# Altium schematic sheet Quad FC V10.0.SchDoc
size A3 portrait; SheetNumber: 1; SheetTotal: 2
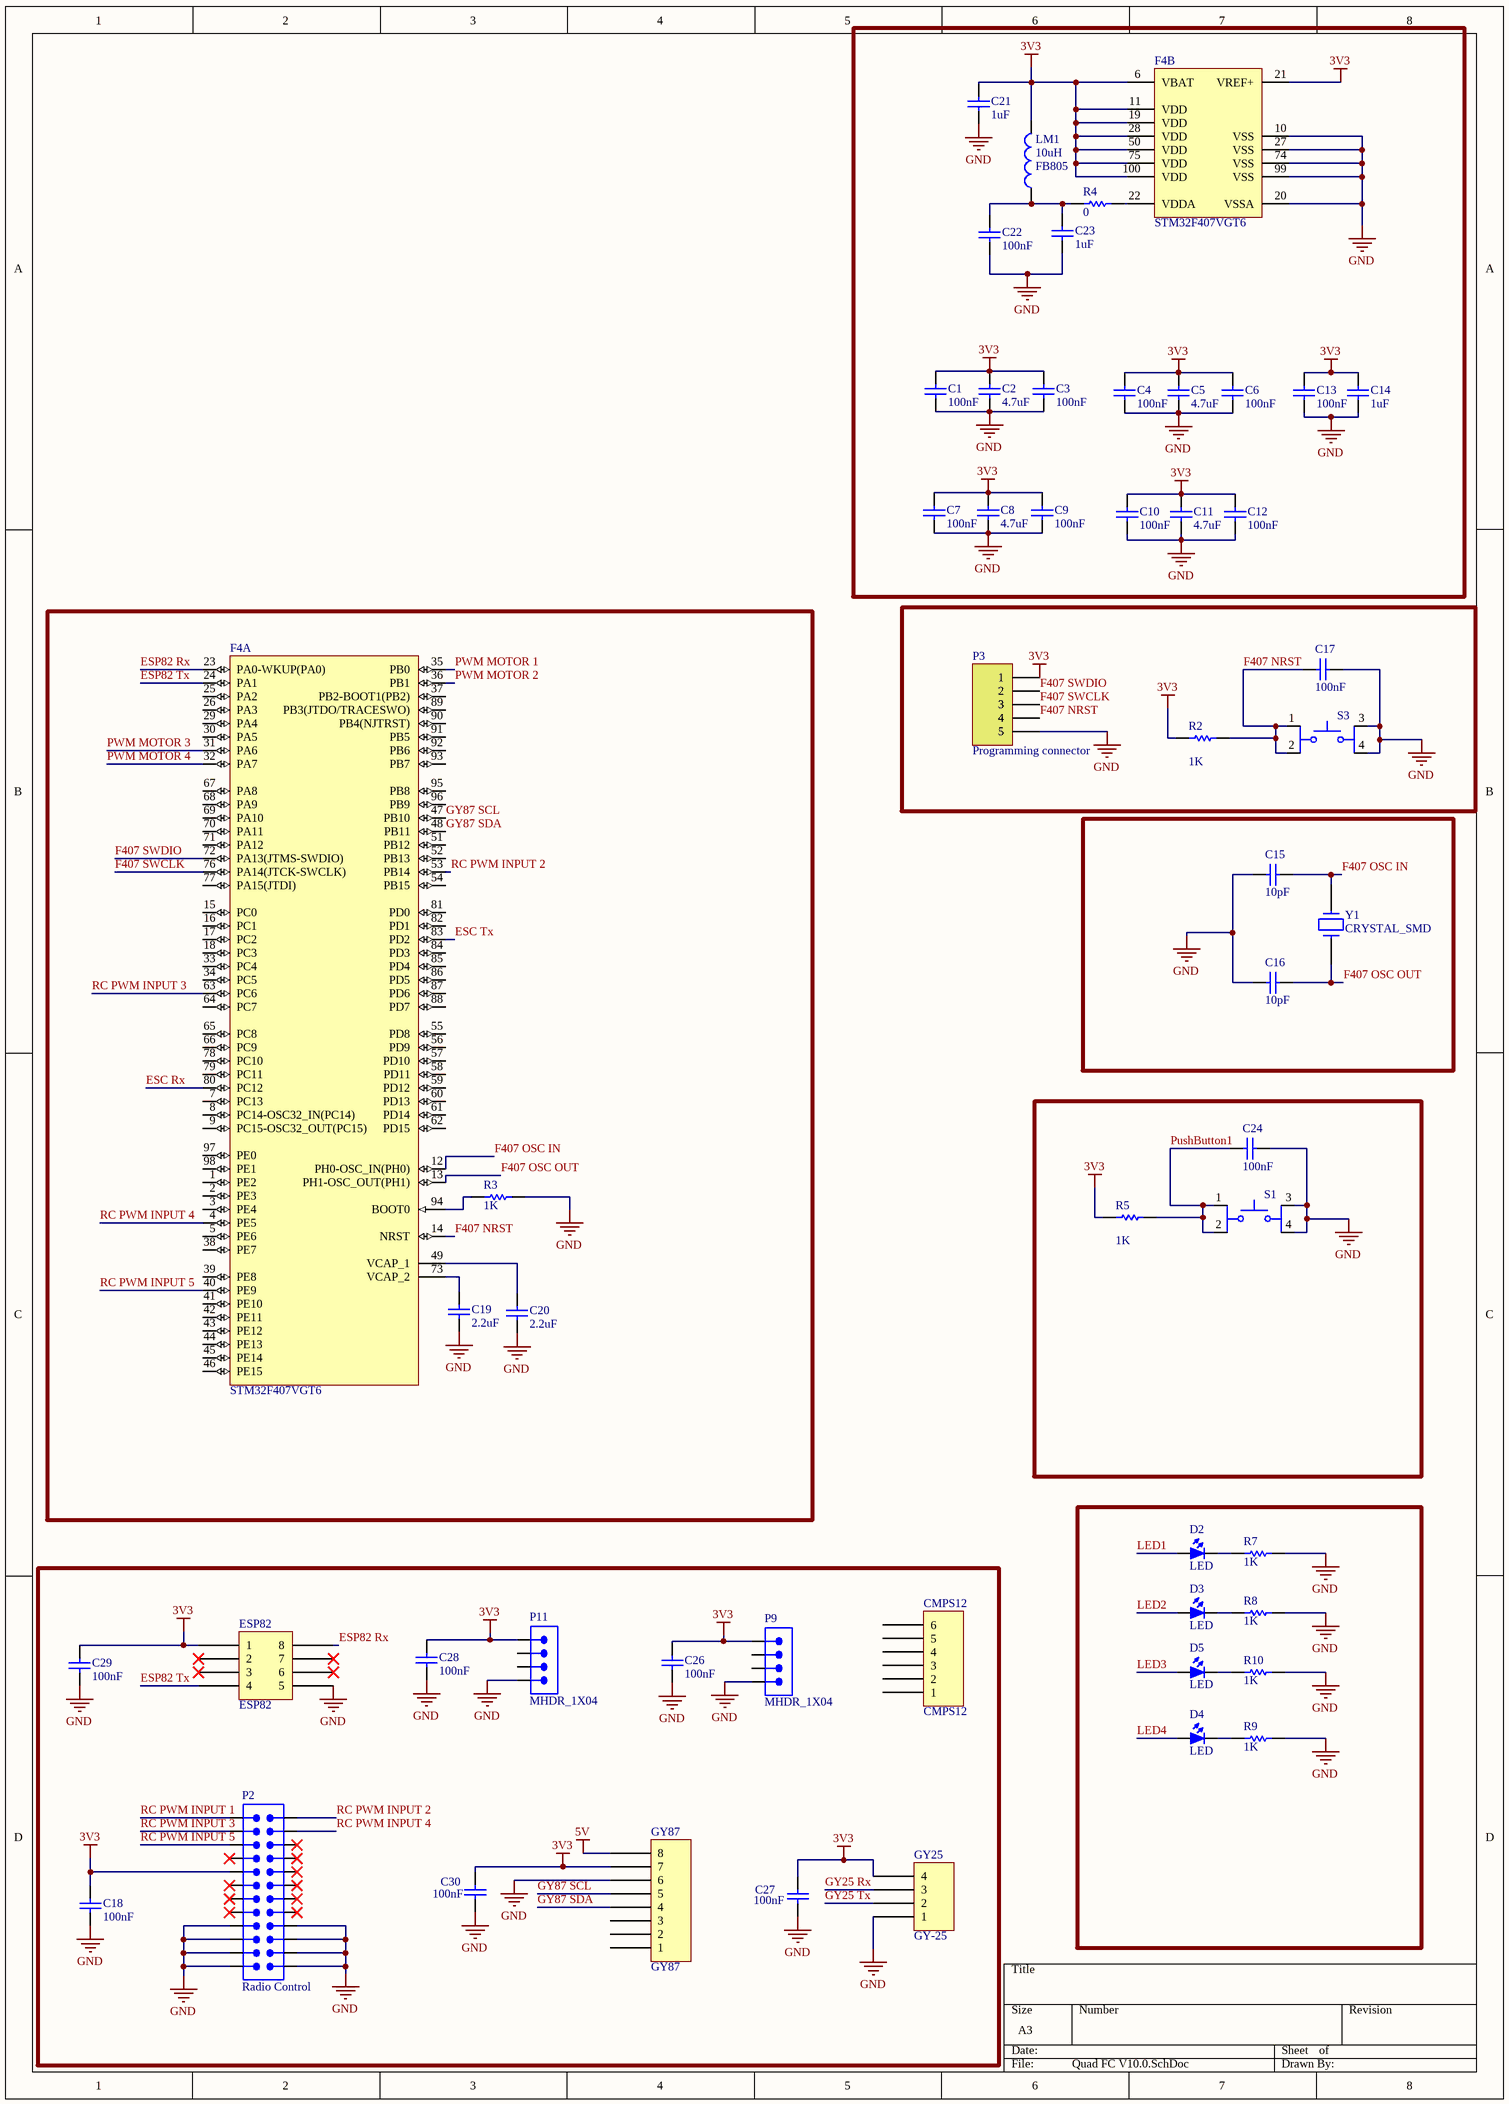
[diagram p0: Quad FC V10.0.SchDoc]

## Parts
C1  100nF  [CAP0603]
C2  4.7uF  [CAP0603]
C3  100nF  [CAP0603]
C4  100nF  [CAP0603]
C5  4.7uF  [CAP0603]
C6  100nF  [CAP0603]
C7  100nF  [CAP0603]
C8  4.7uF  [CAP0603]
C9  100nF  [CAP0603]
C10  100nF  [CAP0603]
C11  4.7uF  [CAP0603]
C12  100nF  [CAP0603]
C13  100nF  [CAP0603]
C14  1uF  [CAP0603]
C15  10pF  [CAP0603]
C16  10pF  [CAP0603]
C17  100nF  [CAP0603]
C18  100nF  [CAP0603]
C19  2.2uF  [CAP0603]
C20  2.2uF  [CAP0603]
C21  1uF  [CAP0603]
C22  100nF  [CAP0603]
C23  1uF  [CAP0603]
C24  100nF  [CAP0603]
C26  100nF  [CAP0603]
C27  100nF  [CAP0603]
C28  100nF  [CAP0603]
C29  100nF  [CAP0603]
C30  100nF  [CAP0603]
CMPS12  CMPS12  [SULLINS NPPN061BFCN]
D2  LED  [0603 - LED]
D3  LED  [0603 - LED]
D4  LED  [0603 - LED]
D5  LED  [0603 - LED]
ESP82  ESP82  [HARWIN M20-7830445]
F4  STM32F407VGT6  [STM-LQFP100_N]  (parts A,B of 2)
GY25  GY-25  [SULLINS NPPN041BFCN]
GY87  GY87  [SULLINS NPPN081BFCN]
LM1  10uH  value FB805  [0805L]
P2  Radio Control  [HEADER8X3]
P3  Programming connector  [Connector1X5]
P9  MHDR_1X04  [JST BM04B-SURS-TF]
P11  MHDR_1X04  [JST BM04B-SURS-TF]
R2  1K  [RES0603]
R3  1K  [RES0603]
R4  0  [RES0603]
R5  1K  [RES0603]
R7  1K  [RES0603]
R8  1K  [RES0603]
R9  1K  [RES0603]
R10  1K  [RES0603]
S1  (no value)  [SW_TL3301FF160QG]
S3  (no value)  [SW_TL3301FF160QG]
Y1  CRYSTAL_SMD  [My_Crystal - SMD]

## Nets
3V3: C1.2 C2.2 C3.2 C4.2 C5.2 C6.2 C7.2 C8.2 C9.2 C10.2 C11.2 C12.2 C13.1 C14.1 C18.1 C21.2 C26.1 C27.1 C28.1 C29.1 C30.2 ESP82.1 F4.6(VBAT) F4.11(VDD) F4.19(VDD) F4.21(VREF+) F4.28(VDD) F4.50(VDD) F4.75(VDD) F4.100(VDD) GY25.4 GY87.7 LM1.2 P2.9 P3.1 P9.1 P11.1 R2.1 R5.1
5V: GY87.8
GND: C1.1 C2.1 C3.1 C4.1 C5.1 C6.1 C7.1 C8.1 C9.1 C10.1 C11.1 C12.1 C13.2 C14.2 C15.1 C16.2 C17.2 C18.2 C19.2 C20.2 C21.1 C22.1 C23.1 C24.2 C26.2 C27.2 C28.2 C29.2 C30.1 ESP82.5 F4.10(VSS) F4.20(VSSA) F4.27(VSS) F4.74(VSS) F4.99(VSS) GY25.1 GY87.6 P2.17 P2.18 P2.19 P2.20 P2.21 P2.22 P2.23 P2.24 P3.5 P9.4 P11.4 R3.2 R7.2 R8.2 R9.2 R10.2 S1.3 S1.4 S3.3 S3.4
ESC Rx: F4.80(PC12)
ESC Tx: F4.83(PD2)
ESP82 Rx: ESP82.8 F4.23(PA0-WKUP(PA0))
ESP82 Tx: ESP82.4 F4.24(PA1)
F407 NRST: C17.1 F4.14(NRST) P3.4 R2.2 S3.1 S3.2
F407 OSC IN: C15.2 F4.12(PH0-OSC_IN(PH0)) Y1.2
F407 OSC OUT: C16.1 F4.13(PH1-OSC_OUT(PH1)) Y1.1
F407 SWCLK: F4.76(PA14(JTCK-SWCLK)) P3.3
F407 SWDIO: F4.72(PA13(JTMS-SWDIO)) P3.2
GY25 Rx: GY25.3
GY25 Tx: GY25.2
GY87 SCL: F4.47(PB10) GY87.5
GY87 SDA: F4.48(PB11) GY87.4
LED1: D2.1(A)
LED2: D3.1(A)
LED3: D5.1(A)
LED4: D4.1(A)
PushButton1: C24.1 R5.2 S1.1 S1.2
PWM MOTOR 1: F4.35(PB0)
PWM MOTOR 2: F4.36(PB1)
PWM MOTOR 3: F4.31(PA6)
PWM MOTOR 4: F4.32(PA7)
RC PWM INPUT 1: P2.1
RC PWM INPUT 2: F4.53(PB14) P2.2
RC PWM INPUT 3: F4.63(PC6) P2.3
RC PWM INPUT 4: F4.4(PE5) P2.4
RC PWM INPUT 5: F4.40(PE9) P2.5
NetC19_1: C19.1 F4.73(VCAP_2)
NetC20_1: C20.1 F4.49(VCAP_1)
NetC22_2: C22.2 C23.2 LM1.1 R4.1
NetD2_2: D2.2(K) R7.1
NetD3_2: D3.2(K) R8.1
NetD4_2: D4.2(K) R9.1
NetD5_2: D5.2(K) R10.1
NetF4_22: F4.22(VDDA) R4.2
NetF4_94: F4.94(BOOT0) R3.1

Not connected (* = marked no-connect by the designer): CMPS12 1 2 3 4 5 6; ESP82 2* 3* 6* 7*; F4 1(PE2) 2(PE3) 3(PE4) 5(PE6) 7(PC13) 8(PC14-OSC32_IN(PC14)) 9(PC15-OSC32_OUT(PC15)) 15(PC0) 16(PC1) 17(PC2) 18(PC3) 25(PA2) 26(PA3) 29(PA4) 30(PA5) 33(PC4) 34(PC5) 37(PB2-BOOT1(PB2)) 38(PE7) 39(PE8) 41(PE10) 42(PE11) 43(PE12) 44(PE13) 45(PE14) 46(PE15) 51(PB12) 52(PB13) 54(PB15) 55(PD8) 56(PD9) 57(PD10) 58(PD11) 59(PD12) 60(PD13) 61(PD14) 62(PD15) 64(PC7) 65(PC8) 66(PC9) 67(PA8) 68(PA9) 69(PA10) 70(PA11) 71(PA12) 77(PA15(JTDI)) 78(PC10) 79(PC11) 81(PD0) 82(PD1) 84(PD3) 85(PD4) 86(PD5) 87(PD6) 88(PD7) 89(PB3(JTDO/TRACESWO)) 90(PB4(NJTRST)) 91(PB5) 92(PB6) 93(PB7) 95(PB8) 96(PB9) 97(PE0) 98(PE1); GY87 1 2 3; P2 6* 7* 8* 10* 11* 12* 13* 14* 15* 16*; P9 2 3; P11 2 3

## Library data of the parts
C1-C24 C26-C30 = CAP SMD PACKAGE: F407VET6 Power CAP; Designer: Abbas Basereh; Desc.: CAP SMD TOTAL PACKAGES; Data: 2017-3-10
CMPS12 = NPPN061BFCN-RC: CONN HDR 6POS 0.079 GOLD PCB; Manufacturer: Sullins Connector Solutions; Connector Type: Header; Contact Length - Post: 0.094" (2.40mm); Current Rating (Amps): 2A; Material Flammability Rating: UL94 V-0; Number of Positions: 6; Number of Positions Loaded: All; Pitch - Mating: 0.079" (2.00mm); Style: Board to Board; Part Number: NPPN061BFCN-RC; ComponentLink1Description: Datasheet; ComponentLink1URL: https://drawings-pdf.s3.amazonaws.com/10483.pdf; ComponentLink2Description: DigiKey Link; ComponentLink2URL: https://www.digikey.com/en/products/detail/sullins-connector-solutions/NPPN061BFCN-RC/804808; Contact Finish - Mating: Gold; Contact Finish - Post: Gold; Contact Finish Thickness - Mating: Flash; Contact Type: Female Socket; Fastening Type: Push-Pull; Insulation Color: Black; Insulation Height: 0.173" (4.40mm); LastUpdated: 6/21/2022 2:43:22 PM; Lifecycle Status: Active; Minimum Order: 1; Mounting Type: Through Hole; Number of Rows: 1; Operating Temperature: -40°C ~ 105°C; Packaging: Tube; Part Status: Active; Price: 0.40; Series: -; Supplier 1: DigiKey; Supplier Part Number 1: S5751-06-ND; Termination: Solder
ESP82 = M20-7830442: CONN RCPT 8POS 0.1 GOLD PCB; Manufacturer: Harwin Inc.; Connector Type: Receptacle; Contact Length - Post: 0.118" (3.00mm); Current Rating (Amps): 3A; Mated Stacking Heights: 11.04mm, 12.63mm; Material Flammability Rating: UL94 V-0; Number of Positions: 8; Number of Positions Loaded: All; Pitch - Mating: 0.100" (2.54mm); Style: Board to Board or Cable; Part Number: M20-7830442; ComponentLink1Description: Datasheet; ComponentLink1URL: https://cdn.harwin.com/pdfs/C001XX_M20_Series_Connectors.pdf; ComponentLink2Description: DigiKey Link; ComponentLink2URL: http://digikey.com/product-detail/en/harwin-inc/M20-7830442/952-1789-ND/3727758; Contact Finish - Mating: Gold; Contact Finish - Post: Tin; Contact Finish Thickness - Mating: Flash; Contact Type: Female Socket; Fastening Type: Push-Pull; Insulation Color: Black; Insulation Height: 0.335" (8.51mm); LastUpdated: 9/21/2022 7:04:26 PM; Lifecycle Status: Active; Minimum Order: 1; Mounting Type: Through Hole; Number of Rows: 2; Operating Temperature: -40°C ~ 105°C; Packaging: Tube; Part Status: Active; Price: 1.36; Row Spacing - Mating: 0.100" (2.54mm); Series: M20; Supplier 1: DigiKey; Supplier Part Number 1: 952-1789-ND; Termination: Solder
F4 = STM32F407VGT6: ARM Cortex-M4 32-bit MCU+FPU, 210 DMIPS, 1024 kB Flash, 192 kB Internal RAM, 82 I/Os, 100-pin LQFP, -40 to 85 degC, Tray; Manufacturer: STMicroelectronics; D/A Converter: 2x12-bit; FLASH Size (Prog) (kB): 1024; I/Os (High Current): 82; Internal RAM Size (kB): 192; Operating Frequency(F) (Processor speed) (MHz): 168; Supply Voltage(Vcc) max (V): 3.6; Supply Voltage(Vcc) min (V): 1.8; DatasheetVersion: Rev. 4; PackageVersion: Rev. 1, 06/2013; PackageReference: LQFP100; PackageDescription: 100-Pin Low Profile Quad Flat Package, 14 x 14 mm Body, 0.5 mm Pitch; Supplier 1: Digi-Key; Supplier Part Number 1: 497-11605-ND; Supplier 2: Farnell; Supplier Part Number 2: 2064368; Supplier 3: Newark; Supplier Part Number 3: 73T2333; Supplier 4: Mouser; Supplier Part Number 4: 511-STM32F407VGT6; Core: ARM Cortex-M4; Packing: Tray; Mounting Technology: Surface Mount; PartNumber: STM32F407VGT6; ComponentLink1Description: Manufacturer URL; ComponentLink1URL: http://www.st.com/web/en/home.html; ComponentLink2Description: Datasheet; ComponentLink2URL: http://www.st.com/st-web-ui/static/active/en/resource/technical/document/datasheet/DM00037051.pdf; ComponentLink3Description: Package Specification; ComponentLink3URL: http://www.st.com/st-web-ui/static/active/en/resource/technical/document/data_brief/DM00071938.pdf
GY25 = NPPN041BFCN-RC: CONN HDR 4POS 0.079 GOLD PCB; Manufacturer: Sullins Connector Solutions; Connector Type: Header; Contact Length - Post: 0.094" (2.40mm); Current Rating (Amps): 2A; Material Flammability Rating: UL94 V-0; Number of Positions: 4; Number of Positions Loaded: All; Pitch - Mating: 0.079" (2.00mm); Style: Board to Board; Part Number: NPPN041BFCN-RC; ComponentLink1Description: Datasheet; ComponentLink1URL: https://drawings-pdf.s3.amazonaws.com/10483.pdf; ComponentLink2Description: DigiKey Link; ComponentLink2URL: https://www.digikey.com/en/products/detail/sullins-connector-solutions/NPPN041BFCN-RC/804806; Contact Finish - Mating: Gold; Contact Finish - Post: Gold; Contact Finish Thickness - Mating: Flash; Contact Type: Female Socket; Fastening Type: Push-Pull; Insulation Color: Black; Insulation Height: 0.173" (4.40mm); LastUpdated: 6/21/2022 2:42:51 PM; Lifecycle Status: Active; Minimum Order: 1; Mounting Type: Through Hole; Number of Rows: 1; Operating Temperature: -40°C ~ 105°C; Packaging: Tube; Part Status: Active; Price: 0.30; Series: -; Supplier 1: DigiKey; Supplier Part Number 1: S5751-04-ND; Termination: Solder
GY87 = NPPN081BFCN-RC: CONN HDR 8POS 0.079 GOLD PCB; Manufacturer: Sullins Connector Solutions; Connector Type: Header; Contact Length - Post: 0.094" (2.40mm); Current Rating (Amps): 2A; Material Flammability Rating: UL94 V-0; Number of Positions: 8; Number of Positions Loaded: All; Pitch - Mating: 0.079" (2.00mm); Style: Board to Board; Part Number: NPPN081BFCN-RC; ComponentLink1Description: Datasheet; ComponentLink1URL: https://drawings-pdf.s3.amazonaws.com/10483.pdf; ComponentLink2Description: DigiKey Link; ComponentLink2URL: https://www.digikey.com/en/products/detail/sullins-connector-solutions/NPPN081BFCN-RC/804810; Contact Finish - Mating: Gold; Contact Finish - Post: Gold; Contact Finish Thickness - Mating: Flash; Contact Type: Female Socket; Fastening Type: Push-Pull; Insulation Color: Black; Insulation Height: 0.173" (4.40mm); LastUpdated: 6/21/2022 2:43:53 PM; Lifecycle Status: Active; Minimum Order: 1; Mounting Type: Through Hole; Number of Rows: 1; Operating Temperature: -40°C ~ 105°C; Packaging: Tube; Part Status: Active; Price: 0.44; Series: -; Supplier 1: DigiKey; Supplier Part Number 1: S5751-08-ND; Termination: Solder
LM1 = L SMA 0.25W: Inductor; Code_IEC: 1005; Published: 8-Jun-2000; LatestRevisionDate: 29-May-2009; LatestRevisionNote: IPC-7351 Footprint Added.; PackageReference: 0402-A; Publisher: Altium Limited; PackageDescription: Chip Inductor; Code_JEITA: 0402
P2 = MHDR_2X12: Male Header 2X12
P3 = Connector1x5: Connector, 5-Pin2.5mm; LatestRevisionDate: 17-Jul-2002; LatestRevisionNote: Re-released for DXP Platform.; Publisher: Altium Limited
P9 P11 = MHDR_1X04: Male Header 1X04
R2-R5 R7-R10 = RES SMD PACKAGE: TOTAL SMD RESISTOR PACK; Designer: Abbas Basereh; Desc.: RES SMD PAKAGES; Data: 2017-3-10
  R2 R3 R5 R7-R10: VALUE: 1K
  R4: VALUE: 0
S1 S3 = TL3301FF160QG: Tactile switch for manual RESET; MF: E-Switch; Package: None; Check_prices: https://www.snapeda.com/parts/TL3301FF160QG/E-Switch/view-part/?ref=eda; Availability: In Stock; MP: TL3301FF160QG; Value: *; Purchase-URL: https://pricing.snapeda.com/search/part/TL3301FF160QG/?ref=eda; Price: None; SnapEDA_Link: https://www.snapeda.com/parts/TL3301FF160QG/E-Switch/view-part/?ref=snap
Y1 = CRYSTAL_SMD: Crystal
D2-D5 = LED: Published: 8-Jun-2000; LatestRevisionDate: 08-Jul-2005; LatestRevisionNote: Mech Layer 1 removed.; PackageReference: LED-0; Publisher: Altium Limited